# EAGLE design blinkm_battir3 (EAGLE 5.09)
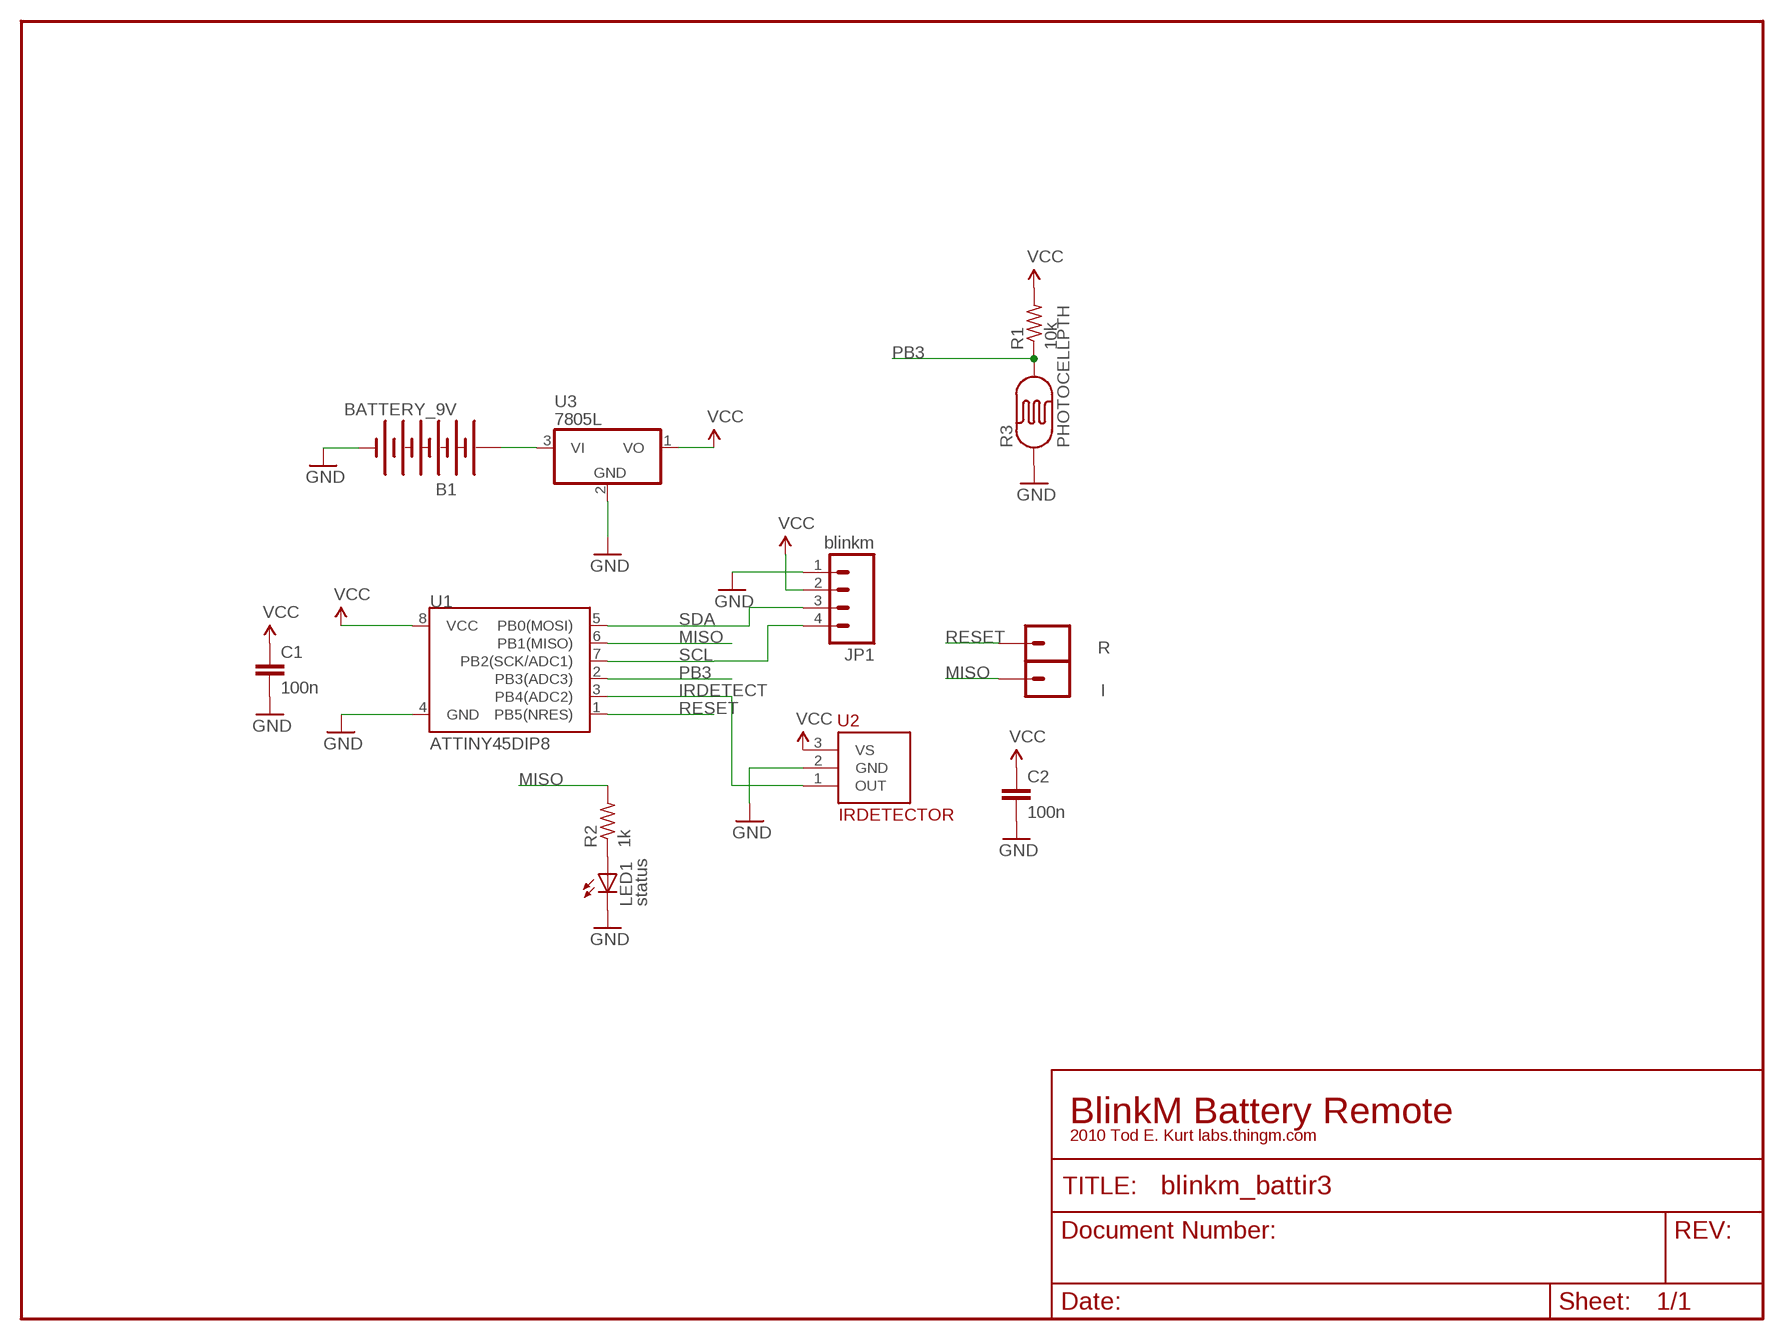
[diagram p0: schematic, sheet 1]

## Parts
B1  BATTERY_9V  [KEYSTONE_968_9V_VERT]
C1  100n  CAPPTH  [CAP-PTH-SMALL]
C2  100n  CAPPTH  [CAP-PTH-SMALL]
I  M01PTH  [1X01]
JP1  blinkm  M04LOCK  [1X04_LOCK]
LED1  status  LED3MM  [LED3MM]
R  M01PTH  [1X01]
R1  10k  R-US_0207/2V  [0207/2V]
R2  1k  R-US_0207/2V  [0207/2V]
R3  PHOTOCELLPTH  [PHOTOCELL]
U1  ATTINY45DIP8  [DIP08]
U2  IRDETECTOR  [3PIN-2.54MM]
U3  7805L  [TO92]

## Nets
9V: B1.+ U3.3(VI)
GND: B1.- C1.2 C2.2 JP1.1 LED1.K(C) R3.1 U1.4(GND) U2.2(GND) U3.2(GND)
IRDETECT: U1.3(PB4(ADC2)) U2.1(OUT)
MISO: I.1 R2.2 U1.6(PB1(MISO))
N$1: LED1.A R2.1
PB3: R1.1 R3.2 U1.2(PB3(ADC3))
RESET: R.1 U1.1(PB5(NRES))
SCL: JP1.4 U1.7(PB2(SCK/ADC1))
SDA: JP1.3 U1.5(PB0(MOSI))
VCC: C1.1 C2.1 JP1.2 R1.2 U1.8(VCC) U2.3(VS) U3.1(VO)

## Notes on the sheet
- BlinkM Battery Remote
- 2010 Tod E. Kurt labs.thingm.com

## Library data of the parts
B1 = todstuff:BATTERY_9V: Keystone Vertical 9V PC snap-on contact http://www.keyelco.com/products/prod29.asp
C1 C2 = SparkFun-20091103:CAP: Capacitor Standard 0603 ceramic capacitor, and 0.1" leaded capacitor.
I R = SparkFun-20091103:M01: Header 1 Standard 1-pin 0.1" header. Use with straight break away headers (SKU : PRT-00116), right angle break away headers (PRT-00553), swiss pins (PRT-00743), machine pins (PRT-00117), and female headers (PRT-00115).
JP1 = SparkFun-20091103:M04: Header 4 Standard 4-pin 0.1" header. Use with straight break away headers (SKU : PRT-00116), right angle break away headers (PRT-00553), swiss pins (PRT-00743), machine pins (PRT-00117), and female headers (PRT-00115). Molex polarized connector foot print use with SKU : PRT-08231 with associated crimp pins and housings.
LED1 = SparkFun-20091103:LED: LEDs Standard schematic elements and footprints for 5mm, 3mm, 1206, and 0603 sized LEDs. 5mm - Spark Fun Electronics SKU : COM-00529 (and others)
R1 R2 = rcl:R-US_: RESISTOR, American symbol
R3 = SparkFun-20091103:PHOTOCELL
U1 = SparkFun-20091103:ATTINY45: Atmel ATTiny45
U2 = todstuff:IRDETECTOR: TSOP348, TSOP322, TSOP382, etc
U3 = linear:78*: Positive VOLTAGE REGULATOR Source: http://cache.national.com/ds/LM/LM78L05.pdf http://www.fairchildsemi.com/ds/LM/LM7805.pdf

## Board
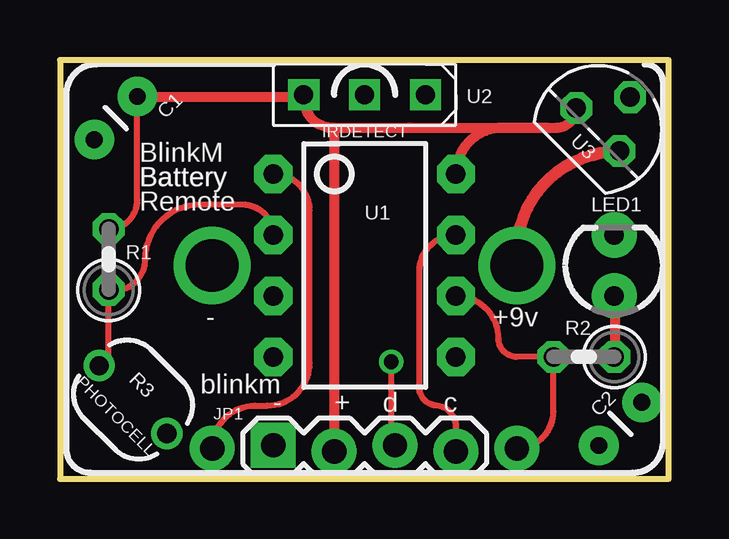
[diagram p1: board, top side]
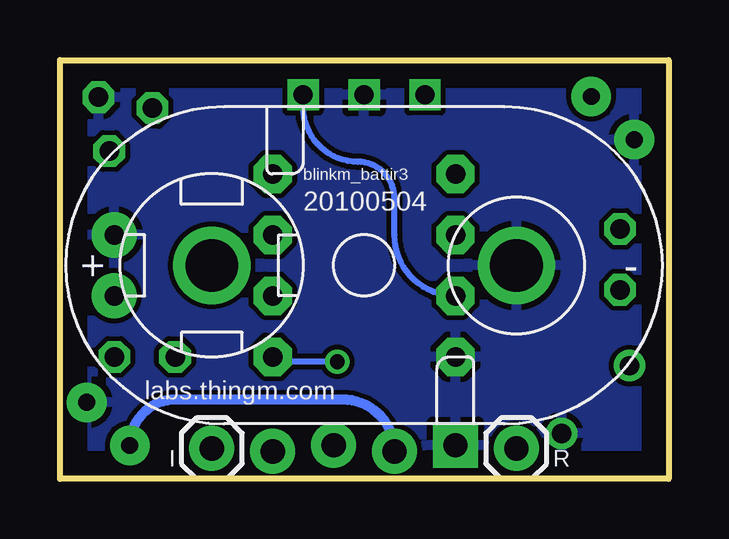
[diagram p2: board, bottom side, seen from below]

Size 25.38 x 17.45 mm. Coordinates in mm from the lower left corner, seen from the top.
Outline: 0,0 25.38,0 25.38,17.45 0,17.45 0,0
Copper layers (1*16): Top 0.035mm / dielectric 1.5mm / Bottom 0.035mm
Design rules "default": minimum track width 10mil, minimum drill 24mil, track to track 8mil, track to pad 8mil, pad to pad 8mil, via to via 8mil, smd to smd 8mil, copper to edge 40mil, drill to drill 8mil, minimum pad ring 10mil, minimum via ring 8mil, stop-mask expansion 4mil, vias tented up to drill 0mil, thermal gap 10mil

### Footprints (pad centres in the part's own frame; a part is rotated, then mirrored left to right if it is on the bottom)
KEYSTONE_968_9V_VERT = drill 2.2 round: + 6.35,0; - -6.35,0
CAP-PTH-SMALL = drill 0.7 pad 1.651 round: 1 0,0; 2 2.54,0
1X01 = drill 1.016 pad 1.88 round: 1 0,0
1X04_LOCK = drill 1.016 pad 1.88 square: 1 0,0.127 | drill 1.016 pad 1.88 round: 2 2.54,-0.127; 3 5.08,0.127; 4 7.62,-0.127
LED3MM = drill 0.813 pad 1.88 round: A -1.27,0; K 1.27,0
0207/2V = drill 0.813 octagon: 1 -1.27,0; 2 1.27,0
PHOTOCELL = drill 0.8 round: 1 -2,0; 2 2,0
DIP08 = drill 0.813 pad 1.6 octagon: 1 -3.81,-3.81; 2 -1.27,-3.81; 3 1.27,-3.81; 4 3.81,-3.81; 5 3.81,3.81; 6 1.27,3.81; 7 -1.27,3.81; 8 -3.81,3.81
3PIN-2.54MM = drill 0.8 square: 1 -2.54,0; 2 0,0; 3 2.54,0
TO92 = drill 0.813 octagon: 1 -1.27,0; 2 0,1.905; 3 1.27,0

### Placement (x,y rotation side)
B1  12.7,8.89 180 bottom
C1  3.23,15.93 225 top
C2  22.47,1.39 45 top
I  19.05,1.27 0 bottom
JP1  8.89,1.27 0 top
LED1  23.11,8.89 90 top
R  6.35,1.27 0 bottom
R1  2.03,9.14 90 top
R2  21.84,5.08 180 top
R3  3.05,3.3 135 top
U1  12.7,8.89 270 top
U2  12.7,16 180 top
U3  22.43,14.55 315 top

### Tracks (layer width: path | path; a pad name or v marks a point on that pad's centre or on a via)
9V
  Top 0.508: B1.+ 19.05,9.38 arc-90 U3.3
GND
  pour Bottom: 0,17.78 27.94,17.78 27.94,-1.27 0,-1.27
IRDETECT
  Bottom 0.254: U2.1 15.24,15.49 arc-90 12.95,13.21 arc90 11.43,11.68 11.43,11.43 11.43,10.16 arc-90 U1.3
MISO
  Top 0.254: U1.6 arc-90 18.29,5.84 arc90 19.05,5.08 R2.2 20.57,2.79 arc-90 I.1
N$1
  Top 0.406: R2.1 23.16,5.28 23.16,7.32 LED1.A
PB3
  Top 0.254: R3.2 2.03,4.88 2.03,7.72 R1.1 arc100 3.56,9.14 arc-90 5.84,11.43 6.6,11.43 7.62,11.43 arc-90 U1.2
RESET
  Top 0.254: R.1 arc-90 8.13,3.05 8.64,3.05 arc90 10.41,4.83 10.41,11.18 arc90 U1.1
SCL
  Top 0.254: U1.7 arc90 14.99,8.64 14.99,6.35 14.99,3.81 arc90 15.75,3.05 arc-90 16.51,2.03 JP1.4
SDA  (via drill 0.61)
  Top 0.254: v13.82,4.88 13.82,1.63 JP1.3
  Bottom 0.254: v13.82,4.88 16.26,4.88 U1.5
VCC
  Top 0.254: 11.38,14.63 arc-90 11.43,14.58 | C1.1 3.23,11.61 arc-90 R1.2
  Top 0.406: JP1.2 11.43,4.32 11.43,14.58 | 20.32,14.63 14.58,14.63 11.38,14.63 arc-90 10.16,15.85 U2.3 arc-90 10.09,15.93 C1.1 | 20.32,14.63 20.71,14.63 arc90 U3.1 | U1.8 arc-90 18.44,14.63 20.32,14.63
  Bottom 0.406: JP1.2 arc-90 13.59,3.3 19.05,3.3 20.56,3.3 arc-90 C2.1

### Text on the board
tPlace: IRDETECT | BlinkM | Battery | Battery | Remote | blinkm | - | + | d | c | PHOTOCELL
bPlace: blinkm_battir3 | 20100504 | labs.thingm.com
tNames: - | +9v